# Altium schematic sheet 原理图.SchDoc
size A3
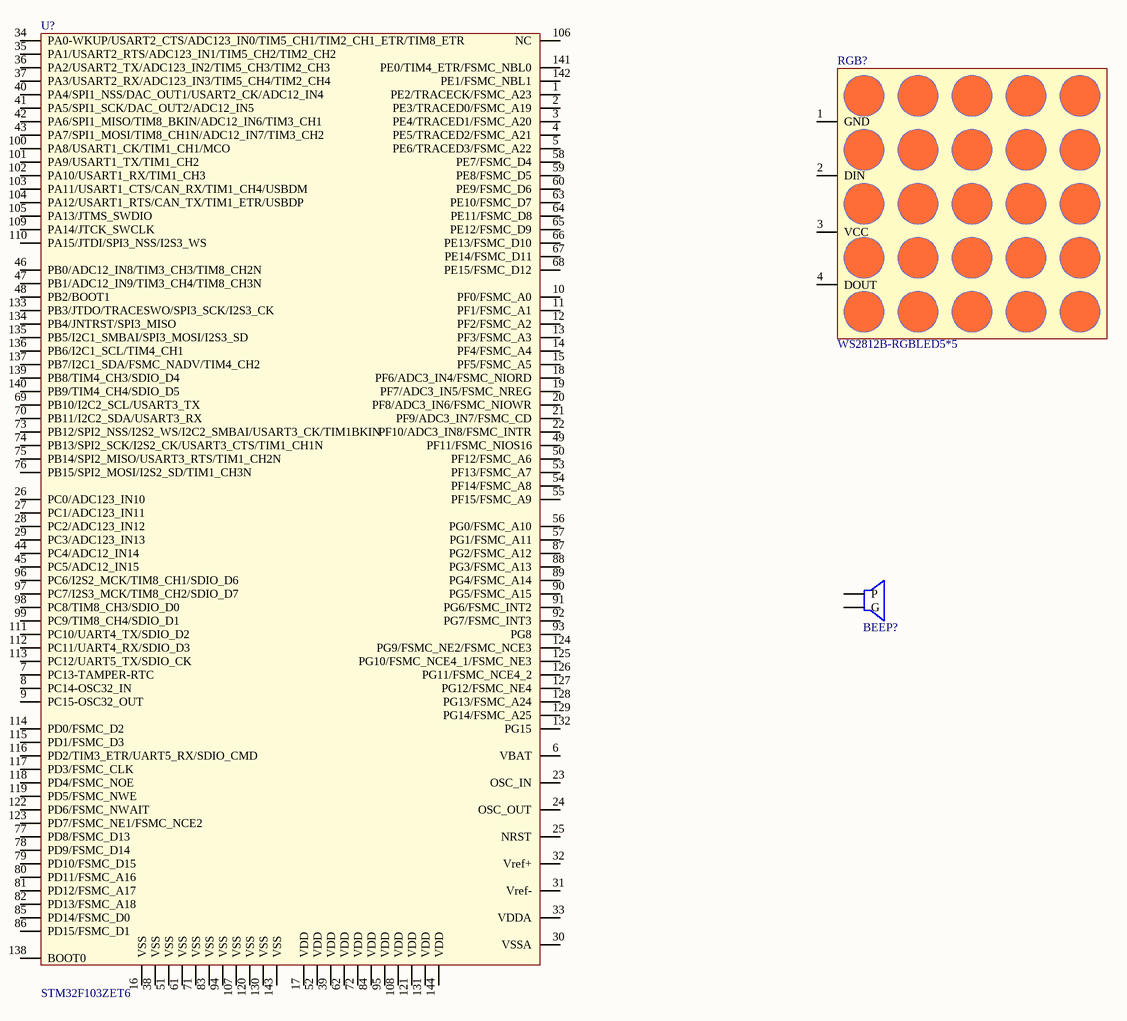
[diagram p0: 原理图.SchDoc]

## Parts
BEEP?  BEEP  [BELL-5]  (value not drawn)
RGB?  WS2812B-RGBLED5*5  [WS2812B-RGBLED5*5]
U?  STM32F103ZET6  [LQFP144]

## Nets

Not connected (* = marked no-connect by the designer): BEEP? 1(P) 2(G); RGB? 1(GND) 2(DIN) 3(VCC) 4(DOUT); U? 1(PE2/TRACECK/FSMC_A23) 2(PE3/TRACED0/FSMC_A19) 3(PE4/TRACED1/FSMC_A20) 4(PE5/TRACED2/FSMC_A21) 5(PE6/TRACED3/FSMC_A22) 6(VBAT) 7(PC13-TAMPER-RTC) 8(PC14-OSC32_IN) 9(PC15-OSC32_OUT) 10(PF0/FSMC_A0) 11(PF1/FSMC_A1) 12(PF2/FSMC_A2) 13(PF3/FSMC_A3) 14(PF4/FSMC_A4) 15(PF5/FSMC_A5) 16(VSS) 17(VDD) 18(PF6/ADC3_IN4/FSMC_NIORD) 19(PF7/ADC3_IN5/FSMC_NREG) 20(PF8/ADC3_IN6/FSMC_NIOWR) 21(PF9/ADC3_IN7/FSMC_CD) 22(PF10/ADC3_IN8/FSMC_INTR) 23(OSC_IN) 24(OSC_OUT) 25(NRST) 26(PC0/ADC123_IN10) 27(PC1/ADC123_IN11) 28(PC2/ADC123_IN12) 29(PC3/ADC123_IN13) 30(VSSA) 31(Vref-) 32(Vref+) 33(VDDA) 34(PA0-WKUP/USART2_CTS/ADC123_IN0/TIM5_CH1/TIM2_CH1_ETR/TIM8_ETR) 35(PA1/USART2_RTS/ADC123_IN1/TIM5_CH2/TIM2_CH2) 36(PA2/USART2_TX/ADC123_IN2/TIM5_CH3/TIM2_CH3) 37(PA3/USART2_RX/ADC123_IN3/TIM5_CH4/TIM2_CH4) 38(VSS) 39(VDD) 40(PA4/SPI1_NSS/DAC_OUT1/USART2_CK/ADC12_IN4) 41(PA5/SPI1_SCK/DAC_OUT2/ADC12_IN5) 42(PA6/SPI1_MISO/TIM8_BKIN/ADC12_IN6/TIM3_CH1) 43(PA7/SPI1_MOSI/TIM8_CH1N/ADC12_IN7/TIM3_CH2) 44(PC4/ADC12_IN14) 45(PC5/ADC12_IN15) 46(PB0/ADC12_IN8/TIM3_CH3/TIM8_CH2N) 47(PB1/ADC12_IN9/TIM3_CH4/TIM8_CH3N) 48(PB2/BOOT1) 49(PF11/FSMC_NIOS16) 50(PF12/FSMC_A6) 51(VSS) 52(VDD) 53(PF13/FSMC_A7) 54(PF14/FSMC_A8) 55(PF15/FSMC_A9) 56(PG0/FSMC_A10) 57(PG1/FSMC_A11) 58(PE7/FSMC_D4) 59(PE8/FSMC_D5) 60(PE9/FSMC_D6) 61(VSS) 62(VDD) 63(PE10/FSMC_D7) 64(PE11/FSMC_D8) 65(PE12/FSMC_D9) 66(PE13/FSMC_D10) 67(PE14/FSMC_D11) 68(PE15/FSMC_D12) 69(PB10/I2C2_SCL/USART3_TX) 70(PB11/I2C2_SDA/USART3_RX) 71(VSS) 72(VDD) 73(PB12/SPI2_NSS/I2S2_WS/I2C2_SMBAI/USART3_CK/TIM1BKIN) 74(PB13/SPI2_SCK/I2S2_CK/USART3_CTS/TIM1_CH1N) 75(PB14/SPI2_MISO/USART3_RTS/TIM1_CH2N) 76(PB15/SPI2_MOSI/I2S2_SD/TIM1_CH3N) 77(PD8/FSMC_D13) 78(PD9/FSMC_D14) 79(PD10/FSMC_D15) 80(PD11/FSMC_A16) 81(PD12/FSMC_A17) 82(PD13/FSMC_A18) 83(VSS) 84(VDD) 85(PD14/FSMC_D0) 86(PD15/FSMC_D1) 87(PG2/FSMC_A12) 88(PG3/FSMC_A13) 89(PG4/FSMC_A14) 90(PG5/FSMC_A15) 91(PG6/FSMC_INT2) 92(PG7/FSMC_INT3) 93(PG8) 94(VSS) 95(VDD) 96(PC6/I2S2_MCK/TIM8_CH1/SDIO_D6) 97(PC7/I2S3_MCK/TIM8_CH2/SDIO_D7) 98(PC8/TIM8_CH3/SDIO_D0) 99(PC9/TIM8_CH4/SDIO_D1) 100(PA8/USART1_CK/TIM1_CH1/MCO) 101(PA9/USART1_TX/TIM1_CH2) 102(PA10/USART1_RX/TIM1_CH3) 103(PA11/USART1_CTS/CAN_RX/TIM1_CH4/USBDM) 104(PA12/USART1_RTS/CAN_TX/TIM1_ETR/USBDP) 105(PA13/JTMS_SWDIO) 106(NC) 107(VSS) 108(VDD) 109(PA14/JTCK_SWCLK) 110(PA15/JTDI/SPI3_NSS/I2S3_WS) 111(PC10/UART4_TX/SDIO_D2) 112(PC11/UART4_RX/SDIO_D3) 113(PC12/UART5_TX/SDIO_CK) 114(PD0/FSMC_D2) 115(PD1/FSMC_D3) 116(PD2/TIM3_ETR/UART5_RX/SDIO_CMD) 117(PD3/FSMC_CLK) 118(PD4/FSMC_NOE) 119(PD5/FSMC_NWE) 120(VSS) 121(VDD) 122(PD6/FSMC_NWAIT) 123(PD7/FSMC_NE1/FSMC_NCE2) 124(PG9/FSMC_NE2/FSMC_NCE3) 125(PG10/FSMC_NCE4_1/FSMC_NE3) 126(PG11/FSMC_NCE4_2) 127(PG12/FSMC_NE4) 128(PG13/FSMC_A24) 129(PG14/FSMC_A25) 130(VSS) 131(VDD) 132(PG15) 133(PB3/JTDO/TRACESWO/SPI3_SCK/I2S3_CK) 134(PB4/JNTRST/SPI3_MISO) 135(PB5/I2C1_SMBAI/SPI3_MOSI/I2S3_SD) 136(PB6/I2C1_SCL/TIM4_CH1) 137(PB7/I2C1_SDA/FSMC_NADV/TIM4_CH2) 138(BOOT0) 139(PB8/TIM4_CH3/SDIO_D4) 140(PB9/TIM4_CH4/SDIO_D5) 141(PE0/TIM4_ETR/FSMC_NBL0) 142(PE1/FSMC_NBL1) 143(VSS) 144(VDD)

## Library data of the parts
BEEP? = BEEP: 3.3V有源蜂鸣器